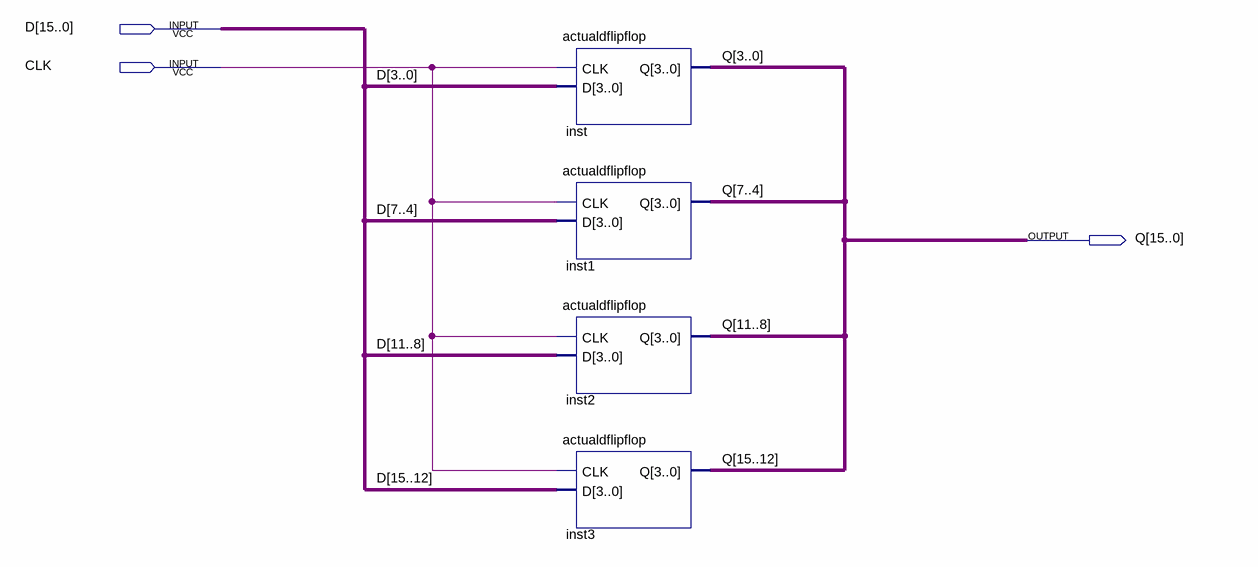
[diagram p0: schematic sheet]
// Quartus schematic onesixflip.bdf as structural Verilog: 4 symbols, 3 pins
module onesixflip (
  input  [15:0] D,
  input  CLK,
  output [15:0] Q
);

  actualdflipflop inst (.CLK(CLK), .D(D[3:0]), .Q(Q[3:0]));
  actualdflipflop inst1 (.CLK(CLK), .D(D[7:4]), .Q(Q[7:4]));
  actualdflipflop inst2 (.CLK(CLK), .D(D[11:8]), .Q(Q[11:8]));
  actualdflipflop inst3 (.CLK(CLK), .D(D[15:12]), .Q(Q[15:12]));
endmodule
